# Altium schematic sheet elekid_03_backup.SchDoc
size A4
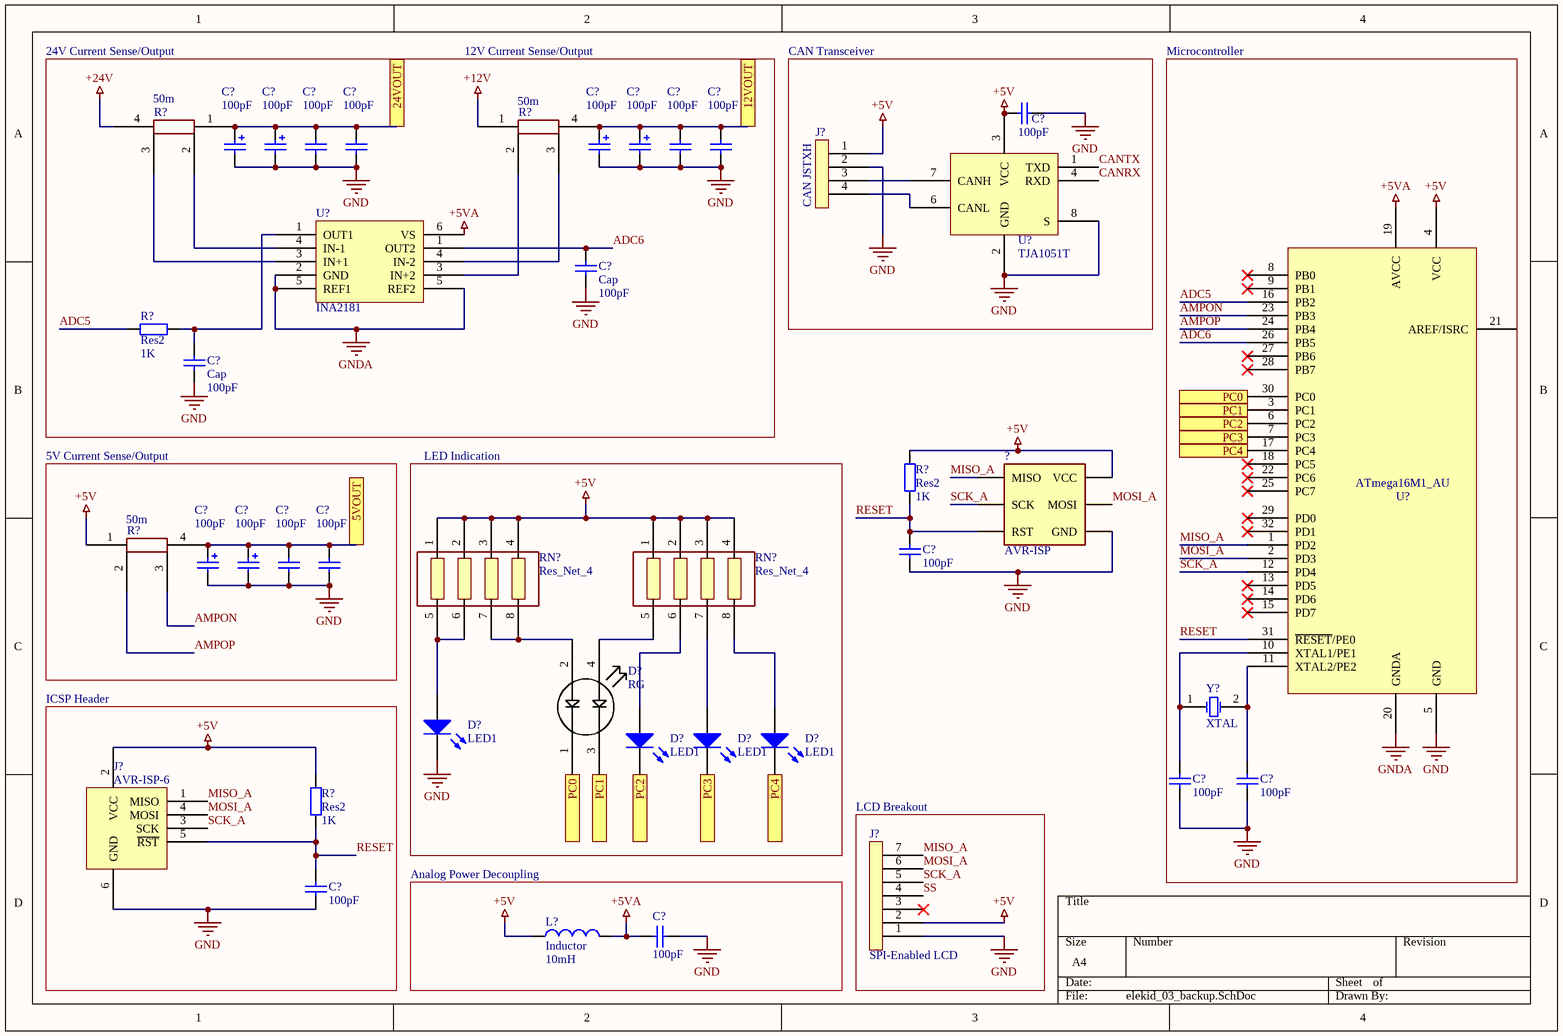
[diagram p0: elekid_03_backup.SchDoc]

## Parts
(Parts that share a designator on the sheet are numbered #1, #2 ... from top to bottom, then left to right.)
?  AVR-ISP  [AVR-ISP]  (mechanical)
C?#1  value 100pF  [RAD-0.3]  (hidden comment: Cap)
C?#2  value 100pF  [POLAR0.8]  (hidden comment: Cap Pol2)
C?#3  value 100pF  [POLAR0.8]  (hidden comment: Cap Pol2)
C?#4  value 100pF  [POLAR0.8]  (hidden comment: Cap Pol2)
C?#5  value 100pF  [POLAR0.8]  (hidden comment: Cap Pol2)
C?#6  value 100pF  [RAD-0.3]  (hidden comment: Cap)
C?#7  value 100pF  [RAD-0.3]  (hidden comment: Cap)
C?#8  value 100pF  [RAD-0.3]  (hidden comment: Cap)
C?#9  value 100pF  [RAD-0.3]  (hidden comment: Cap)
C?#10  Cap  value 100pF  [RAD-0.3]
C?#11  Cap  value 100pF  [RAD-0.3]
C?#12  value 100pF  [RAD-0.3]  (hidden comment: Cap)
C?#13  value 100pF  [POLAR0.8]  (hidden comment: Cap Pol2)
C?#14  value 100pF  [POLAR0.8]  (hidden comment: Cap Pol2)
C?#15  value 100pF  [RAD-0.3]  (hidden comment: Cap)
C?#16  value 100pF  [RAD-0.3]  (hidden comment: Cap)
C?#17  value 100pF  [RAD-0.3]  (hidden comment: Cap)
C?#18  value 100pF  [RAD-0.3]  (hidden comment: Cap)
C?#19  value 100pF  [RAD-0.3]  (hidden comment: Cap)
C?#20  value 100pF  [RAD-0.3]  (hidden comment: Cap)
D?#1  RG
D?#2  LED1  [LED-1]
D?#3  LED1  [LED-1]
D?#4  LED1  [LED-1]
D?#5  LED1  [LED-1]
J?#1  CAN JSTXH
J?#2  AVR-ISP-6
J?#3  SPI-Enabled LCD
L?  Inductor  value 10mH  [0402-A]
R?#1  50m
R?#2  50m
R?#3  Res2  value 1K  [AXIAL-0.4]
R?#4  Res2  value 1K  [AXIAL-0.4]
R?#5  50m
R?#6  Res2  value 1K  [AXIAL-0.4]
RN?#1  Res_Net_4
RN?#2  Res_Net_4
U?#1  TJA1051T
U?#2  INA2181
U?#3  ATmega16M1_AU
Y?  XTAL  [R38]

## Blocks framed on the sheet
CAN Transceiver: C?#1 J?#1 U?#1
Microcontroller: C?#17 C?#18 U?#3 Y?
5V Current Sense/Output: C?#13-C?#16 R?#5
LED Indication: D?#1-D?#5 RN?#1 RN?#2
ICSP Header: C?#19 J?#2 R?#6
LCD Breakout: J?#3
Analog Power Decoupling: C?#20 L?

## Ports
5VOUT, 12VOUT, 24VOUT, PC0, PC1, PC2, PC3, PC4

## Nets
+5V: ?.VCC C?#1.2 J?#1.1 J?#2.2(VCC) J?#3.2 L?.1 R?#4.2 R?#5.1 R?#6.2 RN?#1.1 RN?#1.2 RN?#1.3 RN?#1.4 RN?#2.1 RN?#2.2 RN?#2.3 RN?#2.4 U?#1.3(VCC) U?#3.4(VCC)
+5VA: C?#20.1 L?.2 U?#2.6(VS) U?#3.19(AVCC)
+12V: R?#2.1
+24V: R?#1.4
GND: ?.GND C?#1.1 C?#2.2 C?#3.2 C?#4.2 C?#5.2 C?#6.1 C?#7.1 C?#8.1 C?#9.1 C?#10.1 C?#11.1 C?#12.2 C?#13.2 C?#14.2 C?#15.1 C?#16.1 C?#17.2 C?#18.2 C?#19.2 C?#20.2 D?#2.2(K) J?#1.2 J?#2.6(GND) J?#3.1 U?#1.2(GND) U?#1.8(S) U?#3.5(GND)
GNDA: U?#2.2(GND) U?#2.5(REF1) U?#3.20(GNDA)
5VOUT: C?#13.1 C?#14.1 C?#15.2 C?#16.2 R?#5.4 ; port 5VOUT
12VOUT: C?#4.1 C?#5.1 C?#8.2 C?#9.2 R?#2.4 ; port 12VOUT
24VOUT: C?#2.1 C?#3.1 C?#6.2 C?#7.2 R?#1.1 ; port 24VOUT
ADC5: R?#3.1 U?#3.16(PB2)
ADC6: C?#10.2 U?#2.1(OUT2) U?#3.26(PB5)
AMPON: R?#5.3 U?#3.23(PB3)
AMPOP: R?#5.2 U?#3.24(PB4)
CANRX: U?#1.4(RXD)
CANTX: U?#1.1(TXD)
MISO_A: ?.MISO J?#2.1(MISO) J?#3.7 U?#3.1(PD2)
MOSI_A: ?.MOSI J?#2.4(MOSI) J?#3.6 U?#3.2(PD3)
PC0: D?#1.1 U?#3.30(PC0) ; port PC0
PC1: D?#1.3 U?#3.3(PC1) ; port PC1
PC2: D?#3.2(K) U?#3.6(PC2) ; port PC2
PC3: D?#4.2(K) U?#3.7(PC3) ; port PC3
PC4: D?#5.2(K) U?#3.17(PC4) ; port PC4
RESET: ?.RST C?#12.1 C?#19.1 J?#2.5(~{RST}) R?#4.1 R?#6.1 U?#3.31(~{RESET}/PE0)
SCK_A: ?.SCK J?#2.3(SCK) J?#3.5 U?#3.12(PD4)
SS: J?#3.4
NetC?#11_2: C?#11.2 R?#3.2 U?#2.1(OUT1)
NetC?#17_1: C?#17.1 U?#3.10(XTAL1/PE1) Y?.1(OSC1)
NetC?#18_1: C?#18.1 U?#3.11(XTAL2/PE2) Y?.2(OSC2)
NetD?#1_2: D?#1.2 RN?#1.7 RN?#1.8
NetD?#1_4: D?#1.4 RN?#2.5
NetD?#2_1: D?#2.1(A) RN?#1.5 RN?#1.6
NetD?#3_1: D?#3.1(A) RN?#2.6
NetD?#4_1: D?#4.1(A) RN?#2.7
NetD?#5_1: D?#5.1(A) RN?#2.8
NetJ?#1_3: J?#1.3 U?#1.7(CANH)
NetJ?#1_4: J?#1.4 U?#1.6(CANL)
NetR?#1_2: R?#1.2 U?#2.4(IN-1)
NetR?#1_3: R?#1.3 U?#2.3(IN+1)
NetR?#2_2: R?#2.2 U?#2.3(IN+2)
NetR?#2_3: R?#2.3 U?#2.4(IN-2)

Not connected (* = marked no-connect by the designer): J?#3 3*; U?#3 8(PB0)* 9(PB1)* 13(PD5)* 14(PD6)* 15(PD7)* 18(PC5)* 21(AREF/ISRC) 22(PC6)* 25(PC7)* 27(PB6)* 28(PB7)* 29(PD0)* 32(PD1)*

## Notes on the sheet
- 24V Current Sense/Output
- 12V Current Sense/Output

## Library data of the parts
? = AVR-ISP: Emulators / Simulators AVR USB IN CIRCUIT EMUL/PRGMR ISP; MF: Gravitech; SnapEDA_Link: https://www.snapeda.com/parts/AVR-ISP/Gravitech/view-part/4593377/?ref=snap; MP: AVR-ISP; Availability: Unavailable; Price: None; Value: *; Package: None
C?#1 C?#6-C?#12 C?#15-C?#20 = Cap: Capacitor; Published: 8-Jun-2000; LatestRevisionDate: 17-Jul-2002; LatestRevisionNote: Re-released for DXP Platform.; PackageReference: RAD-0.3; Publisher: Altium Limited; PackageDescription: Radial Cap, Thru-Hole; 2 Leads; 0.3 in Pin Spacing
C?#2-C?#5 C?#13 C?#14 = Cap Pol2: Polarized Capacitor (Axial); Published: 8-Jun-2000; LatestRevisionDate: 17-Jul-2002; LatestRevisionNote: Re-released for DXP Platform.; PackageReference: POLAR0.8; Publisher: Altium Limited; PackageDescription: Polarized Capacitor; 2 Leads
D?#1 = RG_LED
D?#2-D?#5 = LED1: Typical RED GaAs LED; Published: 8-Jun-2000; LatestRevisionDate: 08-Jul-2005; LatestRevisionNote: Mech Layer 1 removed.; PackageReference: LED-1; Publisher: Altium Limited; PackageDescription: LED; 2 Leads
L? = Inductor: Code_IEC: 1005; Published: 8-Jun-2000; LatestRevisionDate: 29-May-2009; LatestRevisionNote: IPC-7351 Footprint Added.; PackageReference: 0402-A; Publisher: Altium Limited; PackageDescription: Chip Inductor; Code_JEITA: 0402
R?#1 R?#2 R?#5 = R_Shunt
R?#3 R?#4 R?#6 = Res2: Resistor; Published: 8-Jun-2000; LatestRevisionDate: 17-Jul-2002; LatestRevisionNote: Re-released for DXP Platform.; PackageReference: AXIAL-0.4; Publisher: Altium Limited; PackageDescription: Axial Device, Thru-Hole; 2 Leads; 0.4 in Pin Spacing
Y? = XTAL: Crystal Oscillator; Published: 8-Jun-2000; LatestRevisionDate: 17-Jul-2002; LatestRevisionNote: Re-released for DXP Platform.; PackageReference: R38; Publisher: Altium Limited; PackageDescription: Crystal, Thru-Hole; 2 Leads; Body 3.1 x 8.2 mm (Dia.xH)